# EAGLE design BHOnOfreBoard (EAGLE 8.3.2)
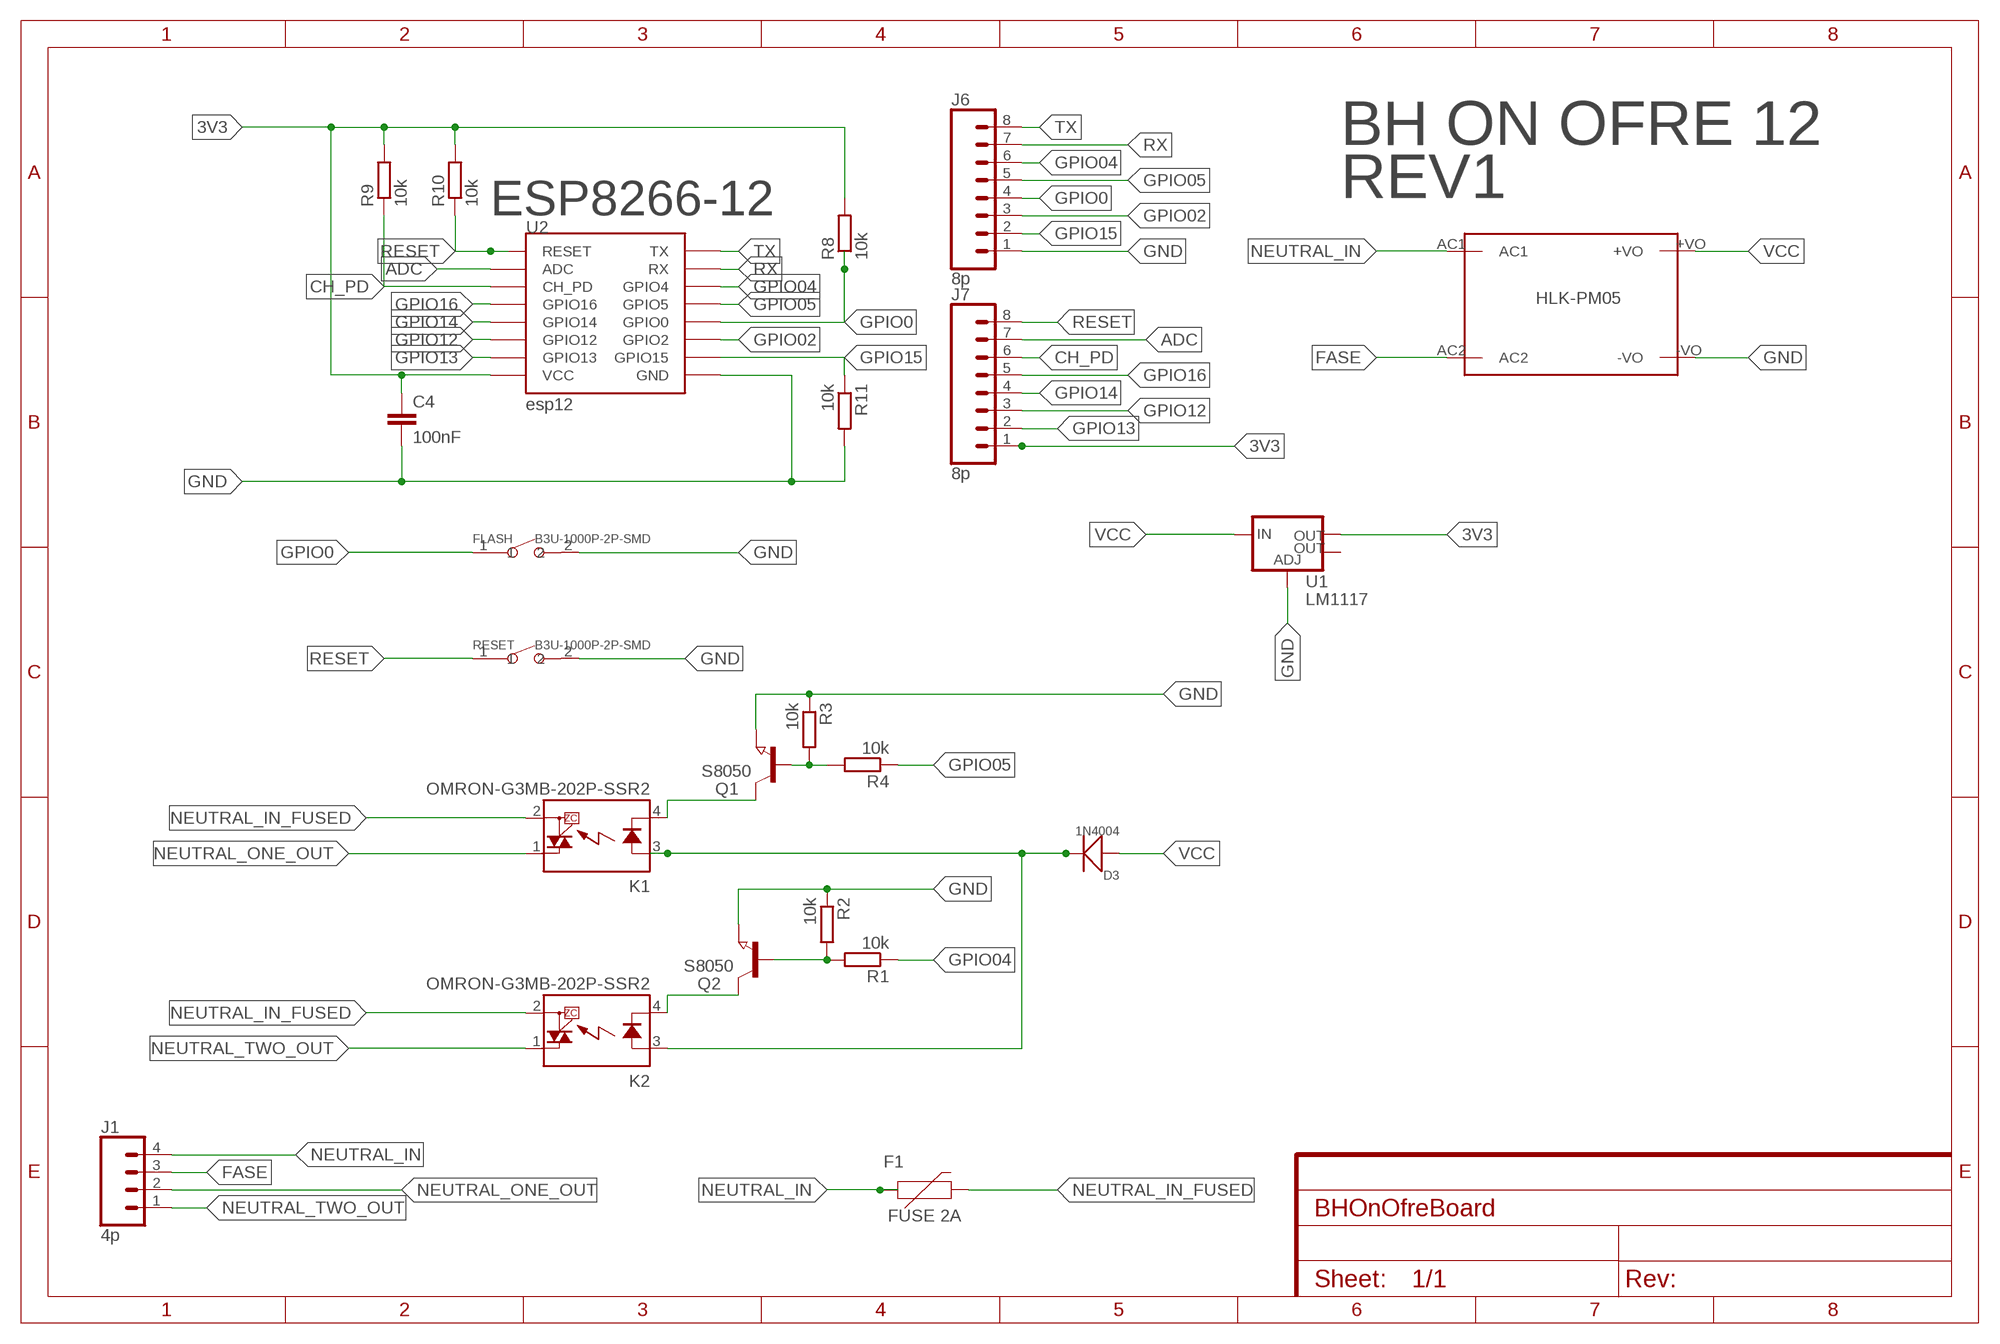
[diagram p0: schematic, sheet 1]

## Parts
C4  100nF  10NF-0603-50V-10%  [0603]
D3  1N4004  DIODE-GEN-PURPOSE-1KV-1A(DO-214AC)  [DO-214AC]
F1  FUSE 2A  PPTC_PTH  [PTH]
FLASH  B3U-1000P-2P-SMD  SMD-BUTTON(2P-3.0X2.5X1.2+0.4MM)-B3U-1000P-2P-SMD  [SW2-2.6-3.0X2.5X1.2+0.4MM]
J1  4p  CONN_04SCREW  [SCREWTERMINAL-3.5MM-4]
J6  8p  CONN_08"  [1X08]
J7  8p  CONN_08"  [1X08]
K1  OMRON-G3MB-202P-SSR2  [OMRON-G3MB-202P-SSR]
K2  OMRON-G3MB-202P-SSR2  [OMRON-G3MB-202P-SSR]
Q1  S8050  NPN-TRANSISTOR_SOT23  [SOT23]
Q2  S8050  NPN-TRANSISTOR_SOT23  [SOT23]
R1  10k  R-EU_R0603  [R0603]
R2  10k  R-EU_R0603  [R0603]
R3  10k  R-EU_R0603  [R0603]
R4  10k  R-EU_R0603  [R0603]
R8  10k  R-EU_R0603  [R0603]
R9  10k  R-EU_R0603  [R0603]
R10  10k  R-EU_R0603  [R0603]
R11  10k  R-EU_R0603  [R0603]
RESET  B3U-1000P-2P-SMD  SMD-BUTTON(2P-3.0X2.5X1.2+0.4MM)-B3U-1000P-2P-SMD  [SW2-2.6-3.0X2.5X1.2+0.4MM]
U1  LM1117  V_REG_LM1117SOT223  [SOT223]
U2  esp12  ESP12SMD  [ESP12-SMD]
U$2  HLK-PM03  [HLK-PM03]

## Nets
3V3: C4.1 J7.1 R8.2 R9.2 R10.2 U1.2(OUT) U2.VCC
ADC: J7.7 U2.ADC
CH_PD: J7.6 R9.1 U2.CH_PD
FASE: J1.3 U$2.AC2
GND: C4.2 FLASH.2 J6.1 Q1.2(E) Q2.2(E) R2.1 R3.1 R11.2 RESET.2 U1.1(ADJ) U2.GND U$2.-VO
GPIO0: FLASH.1 J6.4 R8.1 U2.GPIO0
GPIO02: J6.3 U2.GPIO2
GPIO04: J6.6 R1.1 U2.GPIO4
GPIO05: J6.5 R4.1 U2.GPIO5
GPIO12: J7.3 U2.GPIO12
GPIO13: J7.2 U2.GPIO13
GPIO14: J7.4 U2.GPIO14
GPIO15: J6.2 R11.1 U2.GPIO15
GPIO16: J7.5 U2.GPIO16
N$1: K1.4(K) Q1.3(C)
N$2: D3.2(-) K1.3(A) K2.3(A)
N$7: Q1.1(B) R3.2 R4.2
N$9: K2.4(K) Q2.3(C)
N$13: Q2.1(B) R1.2 R2.2
NEUTRAL_IN: F1.P$1 J1.4 U$2.AC1
NEUTRAL_IN_FUSED: F1.P$2 K1.2(DS2) K2.2(DS2)
NEUTRAL_ONE_OUT: J1.2 K1.1(DS1)
NEUTRAL_TWO_OUT: J1.1 K2.1(DS1)
RESET: J7.8 R10.1 RESET.1 U2.RESET
RX: J6.7 U2.RXD0(RX)
TX: J6.8 U2.TXD0(TX)
VCC: D3.1(+) U1.3(IN) U$2.+VO
Unconnected: U1.4(OUT)

## Notes on the sheet
- BH ON OFRE 12
- REV1
- ESP8266-12
- HLK-PM05

## Library data of the parts
C4 = SparkFun-Capacitors:10NF: 0.01uF/10nF/10,000pF ceramic capacitors A capacitor is a passive two-terminal electrical component used to store electrical energy temporarily in an electric field. CAP-09321; PROD_ID: CAP-00867; VALUE: 10nF
D3 = Seeed-Diode:DIODE-GEN-PURPOSE-1KV-1A(DO-214AC): 304010013; MPN: 1N4007; VALUE: 1N4007
F1 = SparkFun-Fuses:PPTC: Resettable Fuse PPTC Resettable Fuse. Really a sort of resistor with a polymeric positive temperature coefficient whose resistance increases dramatically with an increase in temperature. When heated by the power passing through the resistance rises causing the current to be limited, protecting the circuit. This is achieved by the transition of the polymer from a crystalline to an amorphous state where the conductive carbon separates breaking the conductive pathways found in the cool crystalline structure. When a PPTC cools back down it resumes conducting letting the circuit turn back on. SparkFun Products: SparkFun RedBoard - Programmed with Arduino <https://www.sparkfun.com/products/12757> Pro Micro - 5V/16MHz <https://www.sparkfun.com/products/12640> Arduino Pro 328 - 5V/16MHz <https://www.sparkfun.com/products/10915> MP3 Trigger <https://www.sparkfun.com/products/13720>; PROD_ID: RES-08490; VALUE: 72V/0.25A
FLASH RESET = Seeed-Switch:SMD-BUTTON(2P-3.0X2.5X1.2+0.4MM): 311020047; MPN: B3U-1000P-2P-SMD
J1 = SparkFun-Connectors:CONN_04: Multi connection point. Often used as Generic Header-pin footprint for 0.1 inch spaced/style header connections On any of the 0.1 inch spaced packages, you can populate with these: Break Away Headers - Straight <https://www.sparkfun.com/products/116> (PRT-00116) Break Away Male Headers - Right Angle <https://www.sparkfun.com/products/553> (PRT-00553) Female Headers <https://www.sparkfun.com/products/115> (PRT-00115) Break Away Headers - Machine Pin <https://www.sparkfun.com/products/117> (PRT-00117) Break Away Female Headers - Swiss Machine Pin <https://www.sparkfun.com/products/743> (PRT-00743) For SCREWTERMINALS and SPRING TERMINALS visit here: Screw Terimnals on SparkFun.com <https://www.sparkfun.com/search/results?term=Screw+Terminals> (5mm/3.5mm/2.54mm spacing) This device is also useful as a general connection point to wire up your design to another part of your project. Our various solder wires solder well into these plated through hole pads. Hook-Up Wire - Assortment (Stranded, 22 AWG) <https://www.sparkfun.com/products/11375> (PRT-11375) Hook-Up Wire - Assortment (Solid Core, 22 AWG) <https://www.sparkfun.com/products/11367> (PRT-11367) View the entire wire category on our website here <https://www.sparkfun.com/categories/141> Special notes: Molex polarized connector foot print use with SKU : PRT-08231 with associated crimp pins and housings. 1MM SMD Version SKU: PRT-10208; PROD_ID: 2xCONN-08399; SF_ID: 2xPRT-08084
J6 J7 = SparkFun-Connectors:CONN_08: Multi connection point. Often used as Generic Header-pin footprint for 0.1 inch spaced/style header connections On any of the 0.1 inch spaced packages, you can populate with these: Break Away Headers - Straight <https://www.sparkfun.com/products/116> (PRT-00116) Break Away Male Headers - Right Angle <https://www.sparkfun.com/products/553> (PRT-00553) Female Headers <https://www.sparkfun.com/products/115> (PRT-00115) Break Away Headers - Machine Pin <https://www.sparkfun.com/products/117> (PRT-00117) Break Away Female Headers - Swiss Machine Pin <https://www.sparkfun.com/products/743> (PRT-00743) Arduino Stackable Header - 8 Pin <https://www.sparkfun.com/products/9279> (PRT-09279) For SCREWTERMINALS and SPRING TERMINALS visit here: Screw Terimnals on SparkFun.com <https://www.sparkfun.com/search/results?term=Screw+Terminals> (5mm/3.5mm/2.54mm spacing) This device is also useful as a general connection point to wire up your design to another part of your project. Our various solder wires solder well into these plated through hole pads. Hook-Up Wire - Assortment (Stranded, 22 AWG) <https://www.sparkfun.com/products/11375> (PRT-11375) Hook-Up Wire - Assortment (Solid Core, 22 AWG) <https://www.sparkfun.com/products/11367> (PRT-11367) View the entire wire category on our website here <https://www.sparkfun.com/categories/141> Special notes: Molex polarized connector foot print use with SKU : PRT-08231 with associated crimp pins and housings. 1MM SMD Version SKU: PRT-10208 NOTES ON THE VARIANTS LOCK and LOCK_LONGPADS... This footprint was designed to help hold the alignment of a through-hole component (i.e. 6-pin header) while soldering it into place. You may notice that each hole has been shifted either up or down by 0.005 of an inch from it's more standard position (which is a perfectly straight line). This slight alteration caused the pins (the squares in the middle) to touch the edges of the holes. Because they are alternating, it causes a "brace" to hold the component in place. 0.005 has proven to be the perfect amount of "off-center" position when using our standard breakaway headers. Although looks a little odd when you look at the bare footprint, once you have a header in there, the alteration is very hard to notice. Also,if you push a header all the way into place, it is covered up entirely on the bottom side.; PROD_ID: CONN-08438
K1 K2 = Omron G3MB 202p SSR:OMRON-G3MB-202P-SSR: IT(rms) 8A, Zero Cross type SIP 4pin Triac output SSR Source: http://sharp-world.com/products/device/lineup/data/pdf/datasheet/s102s02_e.pdf; MPN: S202S02F; OC_FARNELL: 1618475; OC_NEWARK: 14N9588
Q1 Q2 = semicon-smd-ipc:NPN-TRANSISTOR_: NPN TRANSISTOR
R1-R4 R8-R11 = resistor:R-EU_: RESISTOR, European symbol
U1 = SparkFun-IC-Power:V_REG_LM1117: Voltage Regulator LM1117 Standard adjustable voltage regulator but in SMD form. Spark Fun Electronics SKU : COM-00595; PROD_ID: VREG-08170
U2 = esp8266modules:ESP12: ESP8266 Wifi module 12
U$2 = PowerSocket:HLK-PM03

## Net classes
1 220V: clearance 2.54 mm

## Board
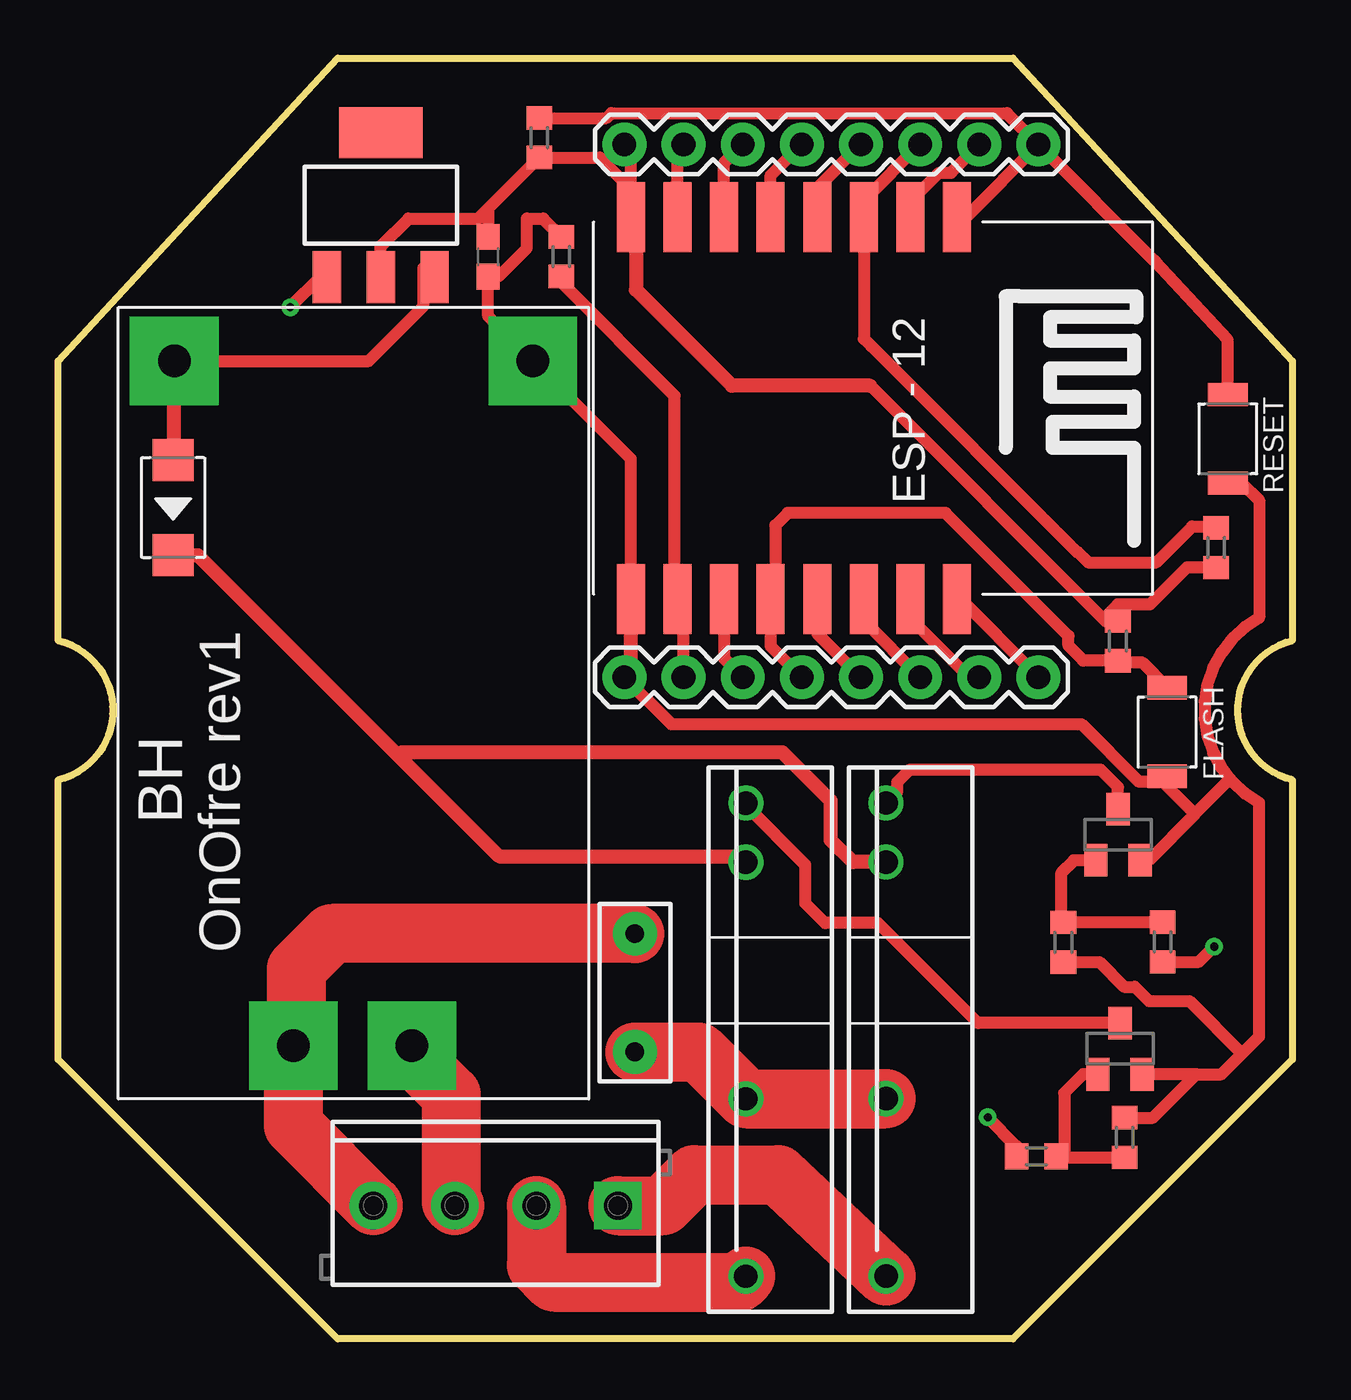
[diagram p1: board, top side]
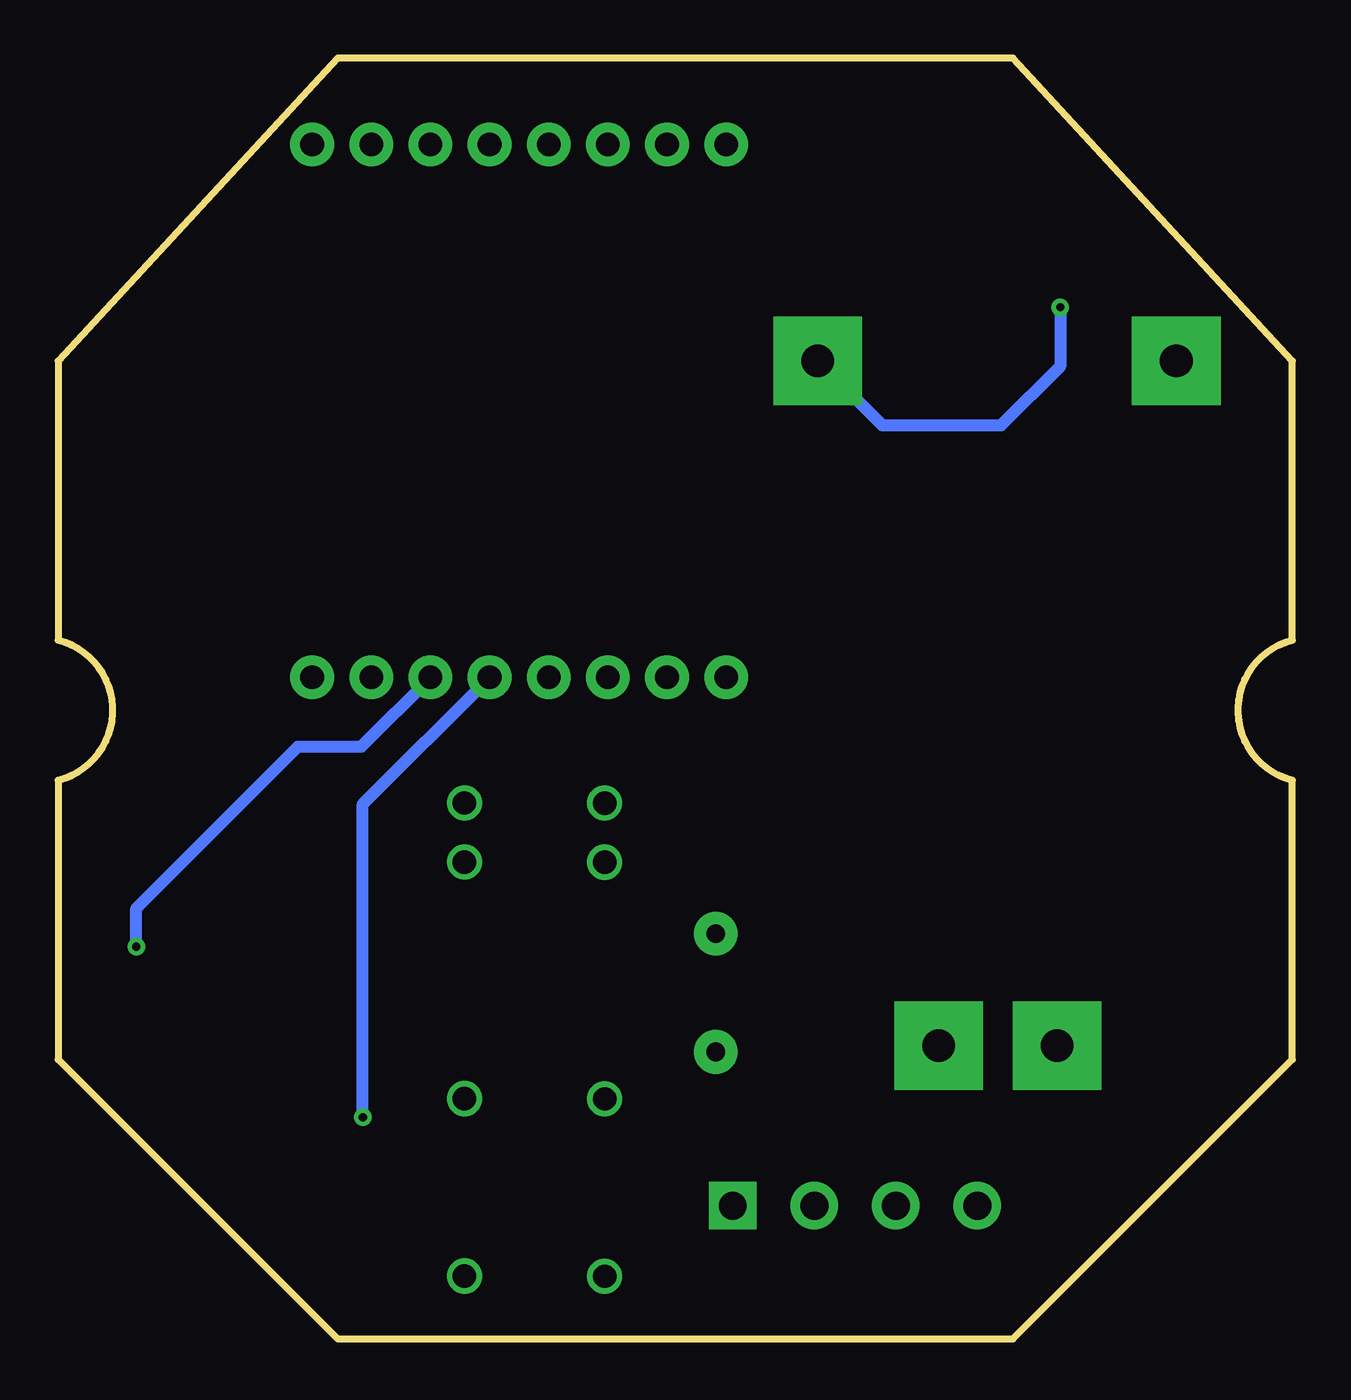
[diagram p2: board, bottom side, seen from below]

Size 53 x 55 mm. Coordinates in mm from the lower left corner, seen from the top.
Outline: 53,12 41,0 12,0 0,12 0,24 arc152 0,30 0,42 12,55 41,55 53,42 53,30 arc152 53,24 53,12
Copper layers (1*16): Top 0.035mm / dielectric 1.5mm / Bottom 0.035mm
Design rules "default": minimum track width 6mil, minimum drill 0.35mm, track to track 6mil, track to pad 6mil, pad to pad 6mil, via to via 6mil, smd to smd 6mil, copper to edge 40mil, drill to drill 6mil, minimum pad ring 10mil, minimum via ring 8mil, stop-mask expansion 4mil, vias tented up to drill 0mil, thermal gap 10mil

### Footprints (pad centres in the part's own frame; a part is rotated, then mirrored left to right if it is on the bottom)
0603 = smd 1.1 x 1: 1 -0.85,0; 2 0.85,0
DO-214AC = smd 1.8 x 1.77: 1 -2.042,0; 2 2.042,0
PTH = drill 0.8 pad 1.88: P$1 -2.54,0; P$2 2.54,0
SW2-2.6-3.0X2.5X1.2+0.4MM = smd 1 x 1.7: 1 -1.9,0; 2 1.9,0
SCREWTERMINAL-3.5MM-4 = drill 1.2 pad 2.032 square: 1 0,0 | drill 1.2 pad 2.032: 2 3.5,0; 3 7,0; 4 10.5,0
1X08 = drill 1.016 pad 1.88: 1 0,0; 2 2.54,0; 3 5.08,0; 4 7.62,0; 5 10.16,0; 6 12.7,0; 7 15.24,0; 8 17.78,0
OMRON-G3MB-202P-SSR = drill 1: 1 -12.7,0; 2 -5.08,0; 3 5.08,0; 4 7.62,0
SOT23 = smd 1 x 1.4: 1 -0.95,-1.1; 2 0.95,-1.1; 3 0,1.1
R0603 = smd 1 x 1.1: 1 -0.85,0; 2 0.85,0
SOT223 = smd 1.219 x 2.235: 1 -2.311,-3.099; 2 0,-3.099; 3 2.311,-3.099 | smd 3.6 x 2.2: 4 0,3.099
ESP12-SMD = smd 3 x 1.2: ADC -8.3,3.8; CH_PD -8.3,1.8; GND 8.1,-8.2; GPIO0 8.1,-2.2; GPIO2 8.1,-4.2; GPIO4 8.1,1.8; GPIO5 8.1,-0.2; GPIO12 -8.3,-4.2; GPIO13 -8.3,-6.2; GPIO14 -8.3,-2.2; GPIO15 8.1,-6.2; GPIO16 -8.3,-0.2; RESET -8.3,5.8; RXD0 8.1,3.8; TXD0 8.1,5.8; VCC -8.3,-8.2
HLK-PM03 = drill 1.4 pad 3.81 square: +VO 29.4,10.2; -VO 29.4,-5.2; AC1 0,5.08; AC2 0,0

### Placement (x,y rotation side)
C4  18.46,46.47 270 top
D3  4.93,35.7 270 top
F1  24.77,14.87 270 top
FLASH  47.62,26.06 270 top
J1  24.03,5.72 180 top
J6  24.32,28.41 0 top
J7  24.32,51.3 0 top
K1  29.53,15.39 90 top
K2  35.55,15.4 90 top
Q1  45.6,12.46 0 top
Q2  45.52,21.66 0 top
R1  47.42,17.04 90 top
R2  43.17,17.04 90 top
R3  45.8,8.65 270 top
R4  42.01,7.84 0 top
R8  45.51,29.98 90 top
R9  49.72,33.98 270 top
R10  20.66,51.58 270 top
R11  21.61,46.48 90 top
RESET  50.23,38.65 270 top
U1  13.85,48.7 0 top
U2  32.8,39.88 270 top
U$2  15.18,12.6 90 top

### Tracks (layer width: path | path; a pad name or v marks a point on that pad's centre or on a via)
3V3
  Top 0.508: R8.2 44.98,30.83 44.88,30.93 | 44.88,30.93 34.87,40.93 | R9.2 48.47,33.13 46.88,31.54 45.5,31.54 44.88,30.93 | 24.01,51.6 J7.1 24.6,51.02 24.6,49.38 | 24.6,49.38 U2.VCC | 13.85,46.35 U1.2 13.85,46.92 15.05,48.11 18.04,48.11 18.46,48.54 | 24.6,49.38 23.25,50.73 R10.2 18.46,48.54 | 18.46,48.54 C4.1
  Top 0.61: 34.87,40.93 28.93,40.93 24.81,45.06 24.81,48.27 U2.VCC
ADC
  Top 0.508: J7.7 38.34,50.08 37.83,50.08 36.6,48.85 U2.ADC
CH_PD
  Top 0.508: 34.65,48.43 U2.CH_PD | U2.CH_PD 34.6,42.95 34.91,42.63 43.77,33.78 43.81,33.78 44.23,33.35 47.15,33.35 48.69,34.89 49.66,34.89 R9.1 | U2.CH_PD 34.6,48.88 J7.6
FASE
  Top 2.54: U$2.AC2 15.18,12.18 16.88,10.48 16.88,5.88 J1.3
GND  (via drill 0.35)
  Top 0.508: J6.1 26.33,26.4 43.93,26.4 46.38,23.94 47.62,23.94 | 50.32,24.05 50.42,23.93 50.97,23.42 51.58,23.03 51.58,12.99 50.83,12.25 | 50.32,24.05 49.96,24.52 49.6,25.18 | U2.GND 24.6,37.79 U$2.-VO 18.46,43.92 C4.2 18.9,45.62 20.13,46.84 20.13,48.11 20.83,48.11 R11.2 | 43.33,16.35 R2.1 44.71,16.18 45.77,15.12 46.23,15.12 46.84,14.51 48.57,14.51 50.83,12.25 | Q2.2 46.83,20.56 48.82,22.55 | 48.82,22.55 50.32,24.05 | 48.88,11.36 Q1.2 | 48.88,11.36 49.95,11.36 50.83,12.25 | R3.1 47.02,9.5 48.88,11.36 | RESET.2 50.84,36.75 51.58,36.02 51.58,30.97 50.97,30.58 50.42,30.07 49.96,29.48 49.6,28.82 49.36,28.11 49.23,27.37 49.23,26.62 49.36,25.89 49.6,25.18 | 49.6,25.18 49.75,24.91 | 47.62,23.94 FLASH.2 | 47.62,23.94 47.62,23.75 48.82,22.55 | U1.1 11.26,45.6 v9.97,44.3
  Top 0.61: U2.GND 24.6,28.69 J6.1
  Bottom 0.508: v9.97,44.3 9.97,41.76 12.51,39.22 17.61,39.22 U$2.-VO
GPIO0
  Top 0.508: J6.4 30.6,29.75 U2.GPIO0 30.79,32.28 30.79,34.93 31.33,35.47 38.11,35.47 43.38,30.2 43.38,29.77 44.02,29.13 R8.1 45.59,29.05 46.58,29.05 47.62,28 FLASH.1
GPIO02
  Top 0.508: U2.GPIO2 28.6,29.21 J6.3
GPIO04  (via drill 0.35)
  Top 0.508: U2.GPIO4 34.6,30.83 J6.6 | R1.1 48.99,16.19 v49.65,16.85
  Bottom 0.508: v49.65,16.85 49.65,18.5 42.7,25.44 39.99,25.44 J6.6
GPIO05  (via drill 0.35)
  Top 0.508: U2.GPIO5 32.6,30.29 J6.5 | R4.1 41.16,8.28 v39.92,9.52
  Bottom 0.508: v39.92,9.52 39.92,22.97 J6.5
GPIO12
  Top 0.508: U2.GPIO12 28.6,50.5 J7.3
GPIO13
  Top 0.508: 26.4,49.48 26.4,48.67 U2.GPIO13 26.6,51.04 J7.2
GPIO14
  Top 0.508: U2.GPIO14 30.6,49.96 J7.4
GPIO15
  Top 0.508: R11.1 21.61,45.36 26.48,40.49 26.48,31.6 | J6.2 26.86,31.22 26.48,31.6 | U2.GPIO15 26.6,31.72 26.48,31.6
GPIO16
  Top 0.508: U2.GPIO16 32.6,49.42 J7.5
N$1
  Top 0.508: K1.4 29.53,22.9 32.08,20.36 32.08,18.72 32.93,17.86 35.21,17.86 39.5,13.56 Q1.3
N$2
  Top 0.61: D3.2 6,33.66 14.63,25.03 | 14.63,25.03 18.94,20.72 29.28,20.72 K1.3 | K2.3 34.12,20.48 33.18,21.42 33.18,23.11 31.1,25.19 14.78,25.19 14.63,25.03
N$7
  Top 0.508: R4.2 42.88,7.87 42.88,7.91 42.99,7.8 43.2,7.8 | 43.2,7.8 R3.2 | Q1.1 44.01,11.36 43.2,10.56 43.2,7.8
N$9
  Top 0.508: Q2.3 45.52,23.7 44.77,24.44 36.56,24.44 36.03,23.91 36.03,23.49 K2.4
N$13
  Top 0.508: Q2.1 43.61,20.56 43.08,20.03 43.08,17.96 | 43.08,17.96 R2.2 | R1.2 R2.2 43.08,17.96
NEUTRAL_IN
  Top 2.54: J1.4 10.1,9.15 U$2.AC1 10.24,12.73 10.24,15.91 11.74,17.41 F1.P$1
NEUTRAL_IN_FUSED
  Top 2.54: F1.P$2 27.52,12.33 K1.2 35.28,10.31 K2.2
NEUTRAL_ONE_OUT
  Top 2.54: J1.2 20.53,3.18 21.27,2.44 29.28,2.44 K1.1
NEUTRAL_TWO_OUT
  Top 2.54: J1.1 25.98,5.72 27.31,7.05 30.93,7.05 K2.1
RESET
  Top 0.508: U2.RESET 38.97,48.18 J7.8 | R10.1 23.55,52.43 23.76,52.64 40.75,52.64 J7.8 | RESET.1 50.23,42.91 47.1,46.29 J7.8
RX
  Top 0.508: 36.6,31.37 U2.RXD0 36.6,30.93 38.79,28.74 39.23,28.74 J6.7
TX
  Top 0.508: U2.TXD0 38.6,31.91 J6.8
VCC
  Top 0.508: U$2.+VO 13.34,42 15.69,44.35 15.69,46 U1.3
  Top 0.61: U$2.+VO 4.98,37.8 D3.1

### Text on the board
tNames: BH | OnOfre rev1